# EAGLE design teplomer (EAGLE 6.5.0)
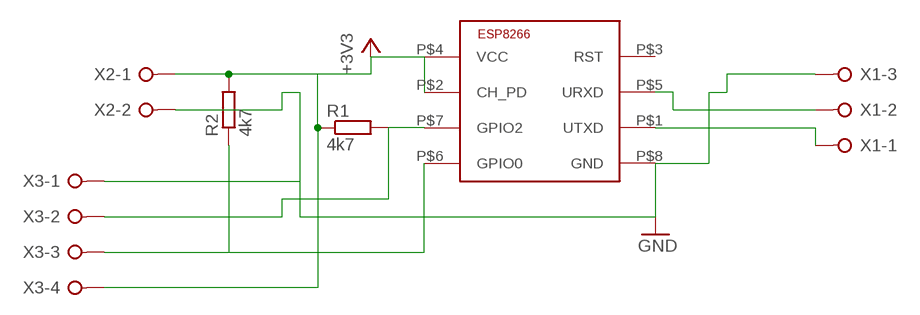
[diagram p0: schematic, sheet 1]

## Parts
R1  4k7  R-EU_0204/5  [0204/5]
R2  4k7  R-EU_0204/5  [0204/5]
U$1  ESP8266-01  [ESP-01]
X1  W237-3E  [W237-3E]
X2  W237-02P  [W237-132]
X3  W237-04P  [W237-4P]

## Nets
+3V3: R1.1 R2.2 U$1.P$2(CH_PD) U$1.P$4(VCC) X2.1 X3.4
GND: U$1.P$8(GND) X1.3 X2.2 X3.1
N$1: U$1.P$5(URXD) X1.2
N$3: U$1.P$1(UTXD) X1.1
N$4: R2.1 U$1.P$6(GPIO0) X3.3
N$5: R1.2 U$1.P$7(GPIO2) X3.2
Unconnected: U$1.P$3(RST)

## Library data of the parts
R1 R2 = rcl:R-EU_: RESISTOR, European symbol
U$1 = ESP8266:ESP8266-01: ESP8266 - ESP-01 Module
X1 = con-wago-508:W237-3E: WAGO SREW CLAMP; OC_FARNELL: unknown; OC_NEWARK: unknown
X2 = con-wago-508:W237-02P: WAGO SREW CLAMP; OC_FARNELL: unknown; OC_NEWARK: unknown
X3 = con-wago-508:W237-04P: WAGO SREW CLAMP; OC_FARNELL: unknown; OC_NEWARK: unknown

## Board
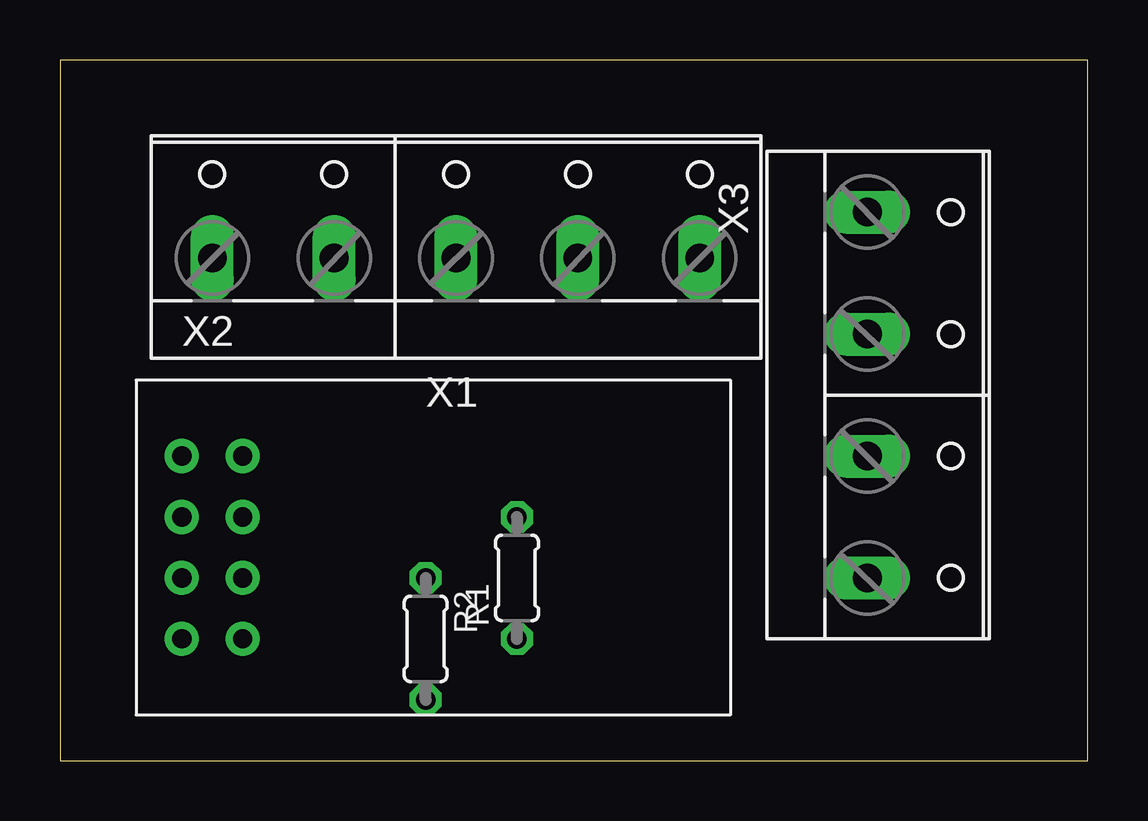
[diagram p1: board, top side]
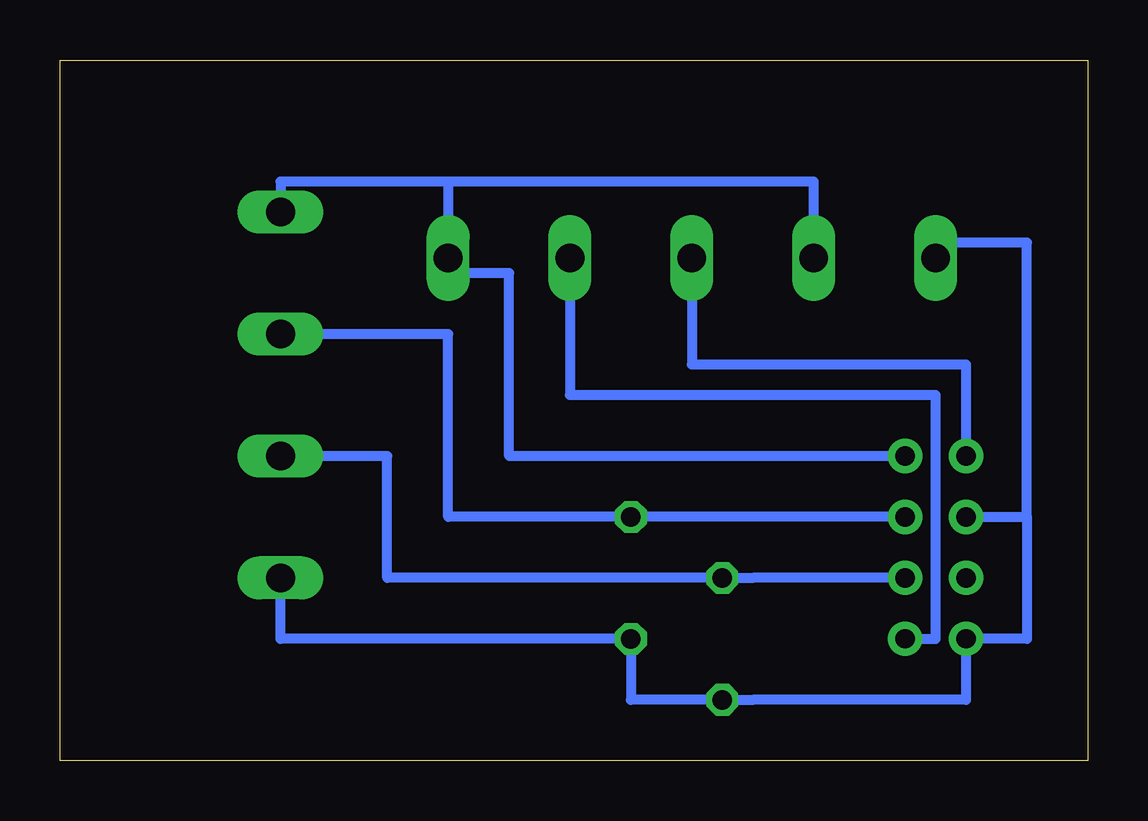
[diagram p2: board, bottom side, seen from below]

Size 42.85 x 29.2 mm. Coordinates in mm from the lower left corner, seen from the top.
Outline: 0,0 42.85,0 42.85,29.2 0,29.2 0,0
Copper layers (1*16): Top 0.035mm / dielectric 1.5mm / Bottom 0.035mm
Design rules "default": minimum track width 10mil, minimum drill 24mil, track to track 8mil, track to pad 8mil, pad to pad 8mil, via to via 8mil, smd to smd 8mil, copper to edge 40mil, drill to drill 8mil, minimum pad ring 10mil, minimum via ring 8mil, stop-mask expansion 4mil, vias tented up to drill 0mil, thermal gap 10mil

### Footprints (pad centres in the part's own frame; a part is rotated, then mirrored left to right if it is on the bottom)
0204/5 = drill 0.813 octagon: 1 -2.54,0; 2 2.54,0
ESP-01 = drill 0.8 pad 1.422: P$1 0,0; P$2 2.54,0; P$3 5.08,0; P$4 7.62,0; P$5 7.62,2.54; P$6 5.08,2.54; P$7 2.54,2.54; P$8 0,2.54
W237-3E = drill 1.194 long: 1 -5.08,-0.635; 2 0,-0.635; 3 5.08,-0.635
W237-132 = drill 1.194 long: 1 -2.54,-0.635; 2 2.54,-0.635
W237-4P = drill 1.194 long: 1 -7.62,-0.635; 2 -2.54,-0.635; 3 2.54,-0.635; 4 7.62,-0.635

### Placement (x,y rotation side)
R1  19.05,7.62 90 top
R2  15.24,5.08 270 top
U$1  5.08,12.7 270 top
X1  21.59,21.59 0 top
X2  8.89,21.59 0 top
X3  34.29,15.24 270 top

### Tracks (layer width: path | path; a pad name or v marks a point on that pad's centre or on a via)
+3V3
  Bottom 0.406: 2.54,10.16 2.54,5.08 U$1.P$4 5.08,2.54 13.97,2.54 R2.2 19.05,2.54 R1.1 33.66,5.08 X3.4 | U$1.P$2 2.54,10.16 | 2.54,10.16 2.54,21.59 6.35,21.59 X2.1
GND
  Bottom 0.406: X3.1 33.66,24.13 26.67,24.13 | X2.2 11.43,24.13 26.67,24.13 | 26.67,24.13 X1.3 26.67,20.32 24.13,20.32 24.13,12.7 U$1.P$8
N$1
  Bottom 0.406: U$1.P$5 6.35,5.08 6.35,15.24 21.59,15.24 X1.2
N$3
  Bottom 0.406: U$1.P$1 5.08,16.51 16.51,16.51 X1.1
N$4
  Bottom 0.406: U$1.P$6 13.97,7.62 R2.1 29.21,7.62 29.21,12.7 X3.3
N$5
  Bottom 0.406: U$1.P$7 R1.2 26.67,10.16 26.67,17.78 X3.2